# EAGLE design SensorNode (EAGLE 7.5.0)
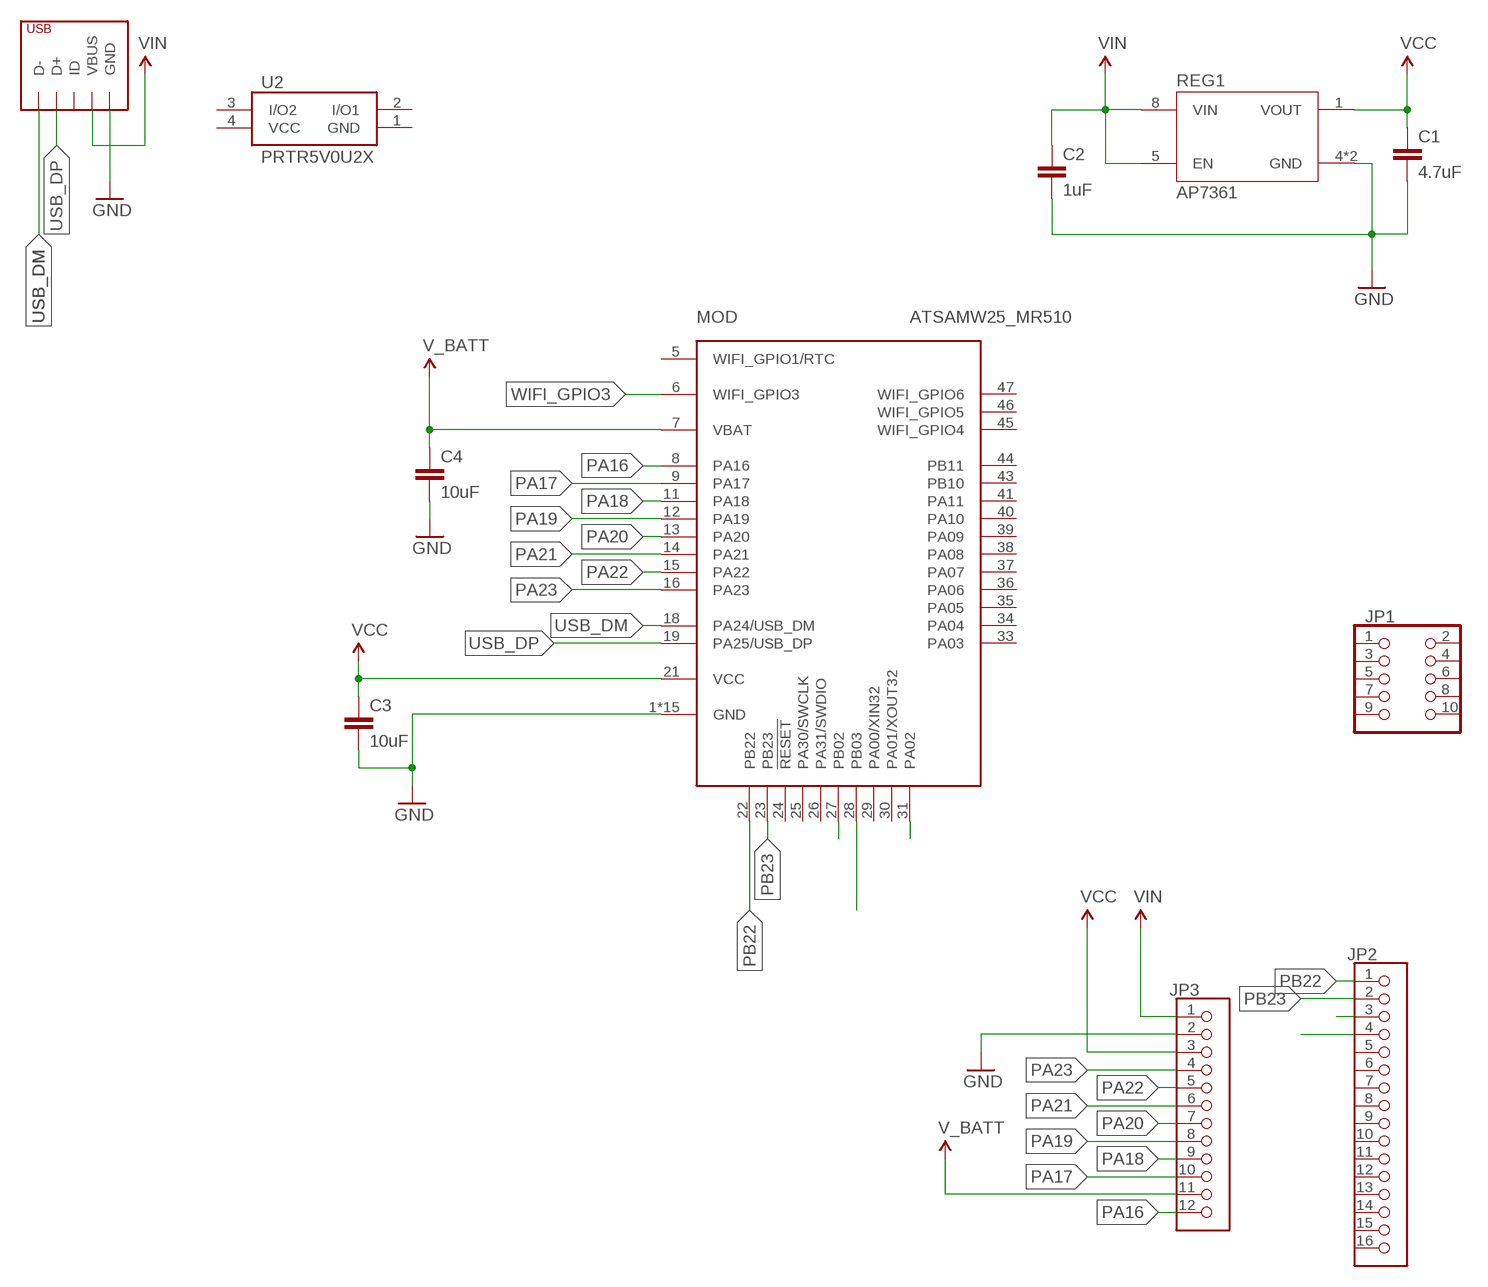
[diagram p0: schematic, sheet 1]

## Parts
C1  4.7uF  C0603  [C0603]
C2  1uF  C0603  [C0603]
C3  10uF  C0603  [C0603]
C4  10uF  C0603  [C0603]
JP1  HEADER_2X5MALE_PTH  [HEADER_50MIL_2X5_PTH]
JP2  HEADER_1X16  [HEADER_100MIL_1X16]
JP3  HEADER_1X12_100MIL  [HEADER_100MIL_1X12]
JP4  USB_RECEPTICLE_MICRO-B  [USB_MICO_B]
MOD  ATSAMW25_MR510  [ATSAMW25]
REG1  AP7361-FGE  [UDFN-8]
U2  PRTR5V0U2X  [SOT143]

## Nets
GND: C1.2 C2.2 C3.2 C4.2 JP3.2 JP4.GND JP4.MOUNT$1(GND) JP4.MOUNT$2(GND) MOD.1(GND) MOD.10(GND) MOD.17(GND) MOD.20(GND) MOD.32(GND) MOD.42(GND) MOD.51(GND) MOD.PAD$1(GND) MOD.PAD$2(GND) MOD.PAD$3(GND) MOD.PAD$4(GND) MOD.PAD$5(GND) MOD.PAD$6(GND) MOD.PAD$7(GND) MOD.PAD$8(GND) REG1.4(GND) REG1.PAD(GND)
N$1: JP2.3
N$2: JP2.4
PA02: MOD.31(PA02)
PA16: JP3.12 MOD.8(PA16)
PA17: JP3.10 MOD.9(PA17)
PA18: JP3.9 MOD.11(PA18)
PA19: JP3.8 MOD.12(PA19)
PA20: JP3.7 MOD.13(PA20)
PA21: JP3.6 MOD.14(PA21)
PA22: JP3.5 MOD.15(PA22)
PA23: JP3.4 MOD.16(PA23)
PB02: MOD.27(PB02)
PB03: MOD.28(PB03)
PB22: JP2.1 MOD.22(PB22)
PB23: JP2.2 MOD.23(PB23)
USB_DM: JP4.D- MOD.18(PA24/USB_DM)
USB_DP: JP4.D+ MOD.19(PA25/USB_DP)
V_BATT: C4.1 JP3.11 MOD.7(VBAT)
VCC: C1.1 C3.1 JP3.3 MOD.21(VCC) REG1.1(VOUT)
VIN: C2.1 JP3.1 JP4.VBUS REG1.5(EN) REG1.8(VIN)
WIFI_GPIO3: MOD.6(WIFI_GPIO3)
Unconnected: JP1.1 JP1.2 JP1.3 JP1.4 JP1.5 JP1.6 JP1.7 JP1.8 JP1.9 JP1.10 JP2.5 JP2.6 JP2.7 JP2.8 JP2.9 JP2.10 JP2.11 JP2.12 JP2.13 JP2.14 JP2.15 JP2.16 JP4.ID MOD.5(WIFI_GPIO1/RTC) MOD.24(!RESET) MOD.25(PA30/SWCLK) MOD.26(PA31/SWDIO) MOD.29(PA00/XIN32) MOD.30(PA01/XOUT32) MOD.33(PA03) MOD.34(PA04) MOD.35(PA05) MOD.36(PA06) MOD.37(PA07) MOD.38(PA08) MOD.39(PA09) MOD.40(PA10) MOD.41(PA11) MOD.43(PB10) MOD.44(PB11) MOD.45(WIFI_GPIO4) MOD.46(WIFI_GPIO5) MOD.47(WIFI_GPIO6) U2.2(I/O1) U2.3(I/O2)

## Power pins joined to a net without a drawn wire
GND: U2.1(GND)
VCC: U2.4(VCC)

## Library data of the parts
C1-C4 = heck:C
JP1 = heck:HEADER_2X5: PIN HEADER
JP2 = heck:HEADER_1X16
JP3 = heck:HEADER_1X12
JP4 = heck:USB_RECEPTICLE: Wurth Electronics Inc 629105136821
MOD = heck:ATSAMW25: IEEE 802.11 b/g/n SmartConnect Wi-Fi Module The Atmel® | SMART SAMW25 module is based on the industry-leading low- power 2.4GHz IEEE® 802.11 b/g/n Wi-Fi® ATWINC1500 SoC (System on Chip) combined with the ARM® Cortex®-M0+ based microcontroller technology from Atmel. * Certified Wi-Fi ATWINC1500B-MU-T with SAMD21 MCU * IEEE 802.11 b/g/n 20MHz (1x1) solution * CryptoAuthentication™ ATECC508 (MR510)
REG1 = heck:AP7361
U2 = heck:PRTR5V0U2X

## Board
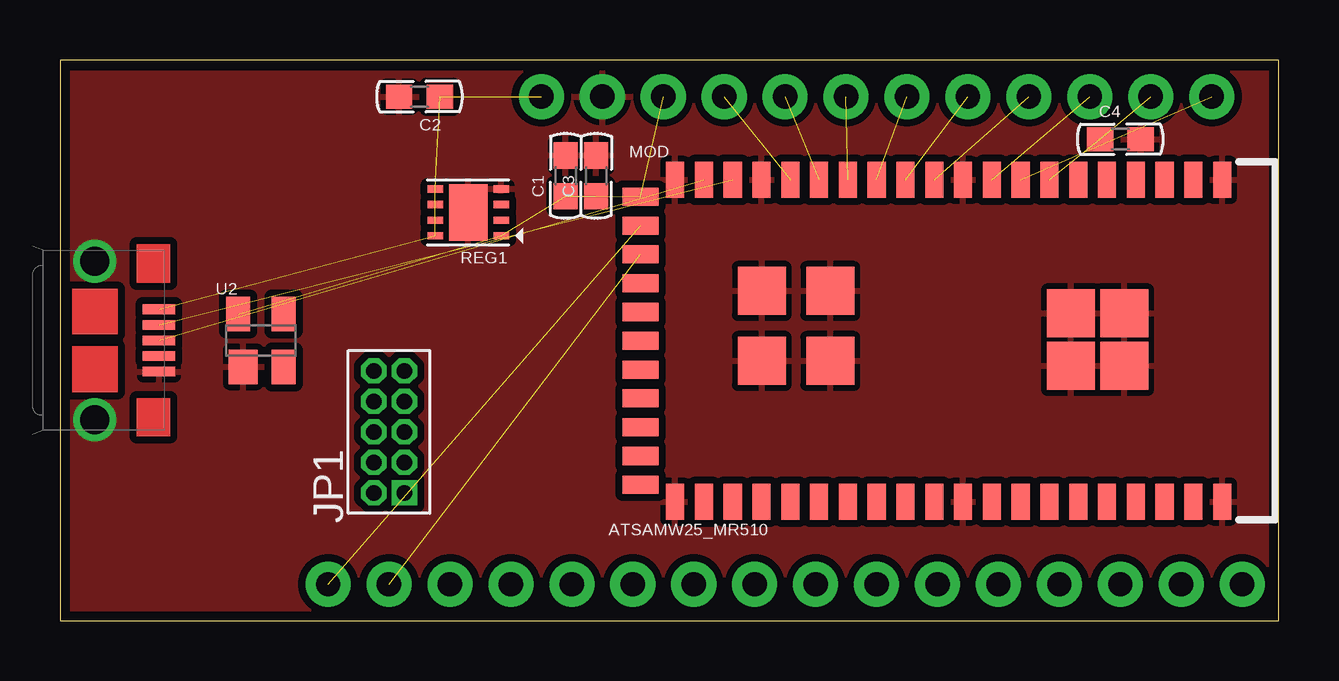
[diagram p1: board, top side]

Size 50.8 x 23.37 mm. Coordinates in mm from the lower left corner, seen from the top.
Outline: 0,0 50.8,0 50.8,23.37 0,23.37 0,0
Copper layers (1*16): Top 0.0356mm / dielectric 1.5011mm / Bottom 0.0356mm
Design rules "heck": minimum track width 6mil, minimum drill 13mil, track to track 6mil, track to pad 6mil, pad to pad 6mil, via to via 6mil, smd to smd 6mil, copper to edge 15mil, drill to drill 6mil, minimum pad ring 7mil, minimum via ring 7mil, stop-mask expansion 3mil, vias tented up to drill 20mil, thermal gap 10mil

### Footprints (pad centres in the part's own frame; a part is rotated, then mirrored left to right if it is on the bottom)
C0603 = smd 1.1 x 1: 1 -0.85,0; 2 0.85,0
HEADER_50MIL_2X5_PTH = drill 0.65 pad 1.05 square: 1 -2.54,-0.635 | drill 0.65 pad 1.05 octagon: 2 -2.54,0.635; 3 -1.27,-0.635; 4 -1.27,0.635; 5 0,-0.635; 6 0,0.635; 7 1.27,-0.635; 8 1.27,0.635; 9 2.54,-0.635; 10 2.54,0.635
HEADER_100MIL_1X16 = drill 1.016 pad 1.88: 1 -19.05,0; 2 -16.51,0; 3 -13.97,0; 4 -11.43,0; 5 -8.89,0; 6 -6.35,0; 7 -3.81,0; 8 -1.27,0; 9 1.27,0; 10 3.81,0; 11 6.35,0; 12 8.89,0; 13 11.43,0; 14 13.97,0; 15 16.51,0; 16 19.05,0
HEADER_100MIL_1X12 = drill 1.016 pad 1.88: 1 -13.97,0; 2 -11.43,0; 3 -8.89,0; 4 -6.35,0; 5 -3.81,0; 6 -1.27,0; 7 1.27,0; 8 3.81,0; 9 6.35,0; 10 8.89,0; 11 11.43,0; 12 13.97,0
USB_MICO_B = smd 0.4 x 1.35: D+ 0,4.125; D- -0.65,4.125; GND 1.3,4.125; ID 0.65,4.125; VBUS -1.3,4.125 | drill 1.2 pad 1.5: MOUNT$1 -3.3,1.45; MOUNT$2 3.3,1.45
ATSAMW25 = smd 0.754 x 1.5: 1 -2.36,6.688; 2 -3.56,6.688; 3 -4.76,6.688; 4 -5.96,6.688; 5 -7.16,6.688; 6 -8.36,6.688; 7 -9.56,6.688; 8 -10.76,6.688; 9 -11.96,6.688; 10 -13.16,6.688; 11 -14.36,6.688; 12 -15.56,6.688; 13 -16.76,6.688; 14 -17.96,6.688; 15 -19.16,6.688; 16 -20.36,6.688; 17 -21.56,6.688; 18 -22.76,6.688; 19 -23.96,6.688; 20 -25.16,6.688; 32 -25.16,-6.72; 33 -23.96,-6.72; 34 -22.76,-6.72; 35 -21.56,-6.72; 36 -20.36,-6.72; 37 -19.16,-6.72; 38 -17.96,-6.72; 39 -16.76,-6.72; 40 -15.56,-6.72; 41 -14.36,-6.72; 42 -13.16,-6.72; 43 -11.96,-6.72; 44 -10.76,-6.72; 45 -9.56,-6.72; 46 -8.36,-6.72; 47 -7.16,-6.72; 48 -5.96,-6.72; 49 -4.76,-6.72; 50 -3.56,-6.72; 51 -2.36,-6.72 | smd 1.5 x 0.754: 21 -26.608,5.984; 22 -26.608,4.784; 23 -26.608,3.584; 24 -26.608,2.384; 25 -26.608,1.184; 26 -26.608,-0.016; 27 -26.608,-1.216; 28 -26.608,-2.416; 29 -26.608,-3.616; 30 -26.608,-4.816; 31 -26.608,-6.016 | smd 2 x 2: PAD$1 -21.549,2.069; PAD$2 -18.694,2.069; PAD$3 -21.549,-0.855; PAD$4 -18.694,-0.855; PAD$5 -8.656,1.122; PAD$6 -6.439,1.122; PAD$7 -8.656,-1.06; PAD$8 -6.439,-1.06
UDFN-8 = smd 0.3 x 0.65: 1 -0.975,-1.375; 2 -0.325,-1.375; 3 0.325,-1.375; 4 0.975,-1.375; 5 0.975,1.375; 6 0.325,1.375; 7 -0.325,1.375; 8 -0.975,1.375 | smd 2.35 x 1.6: PAD 0,0
SOT143 = smd 1.2 x 1.44: 1 -0.75,-1.1 | smd 1 x 1.44: 2 0.95,-1.1; 3 0.95,1.1; 4 -0.95,1.1

### Placement (x,y rotation side)
C1  21.08,18.54 90 top
C2  14.99,21.84 180 top
C3  22.35,18.54 90 top
C4  44.2,20.07 0 top
JP1  13.72,7.87 90 top
JP2  30.23,1.52 0 top
JP3  34.04,21.84 0 top
JP4  0,11.68 270 top
MOD  50.8,11.68 0 top
REG1  17.02,17.02 90 top
U2  8.38,11.68 0 top

### Tracks (layer width: path | path; a pad name or v marks a point on that pad's centre or on a via)
GND
  pour Top (isolate 0.305, rank 6): 0,22.86 50.8,22.86 50.8,0 0,0
PA16  (1 unrouted)
PA17  (1 unrouted)
PA18  (1 unrouted)
PA19  (1 unrouted)
PA20  (1 unrouted)
PA21  (1 unrouted)
PA22  (1 unrouted)
PA23  (1 unrouted)
PB22  (1 unrouted)
PB23  (1 unrouted)
USB_DM  (1 unrouted)
USB_DP  (1 unrouted)
V_BATT  (2 unrouted)
VCC  (5 unrouted)
VIN  (4 unrouted)

### Text on the board
Measures: Units in inches